# Altium schematic sheet TopSheet.SchDoc
size A
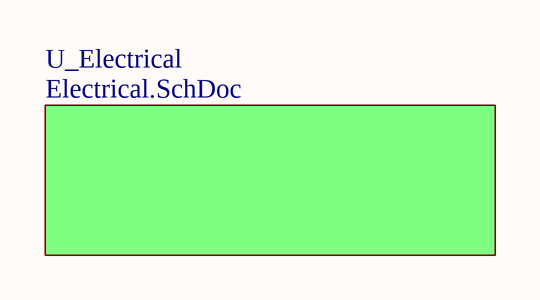
[diagram p0: TopSheet.SchDoc]

## Sub-sheets
U_Electrical = Electrical.SchDoc: no entries